# EAGLE design main_board (EAGLE 9.4.2)
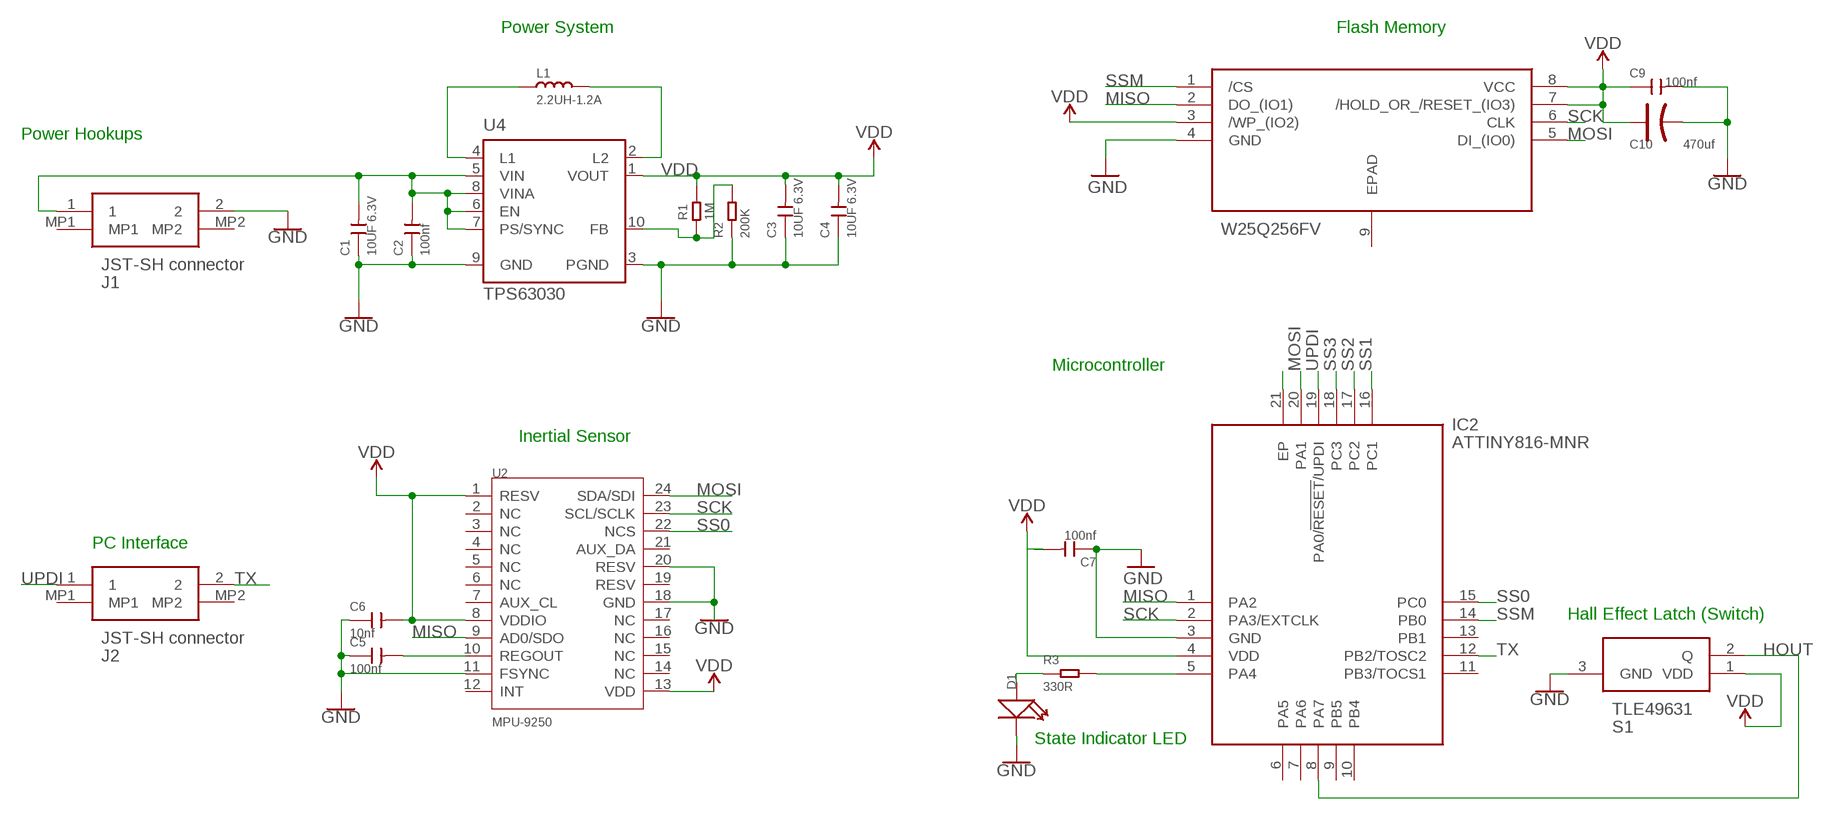
[diagram p0: schematic, sheet 1]

## Parts
C1  10UF 6.3V  CERAMIC-10UF-6.3V-20%-X5R(0603)  [C0603]
C2  100nf  CERAMIC-100NF-50V-10%-X7R(0603)  [C0603]
C3  10UF 6.3V  CERAMIC-10UF-6.3V-20%-X5R(0603)  [C0603]
C4  10UF 6.3V  CERAMIC-10UF-6.3V-20%-X5R(0603)  [C0603]
C5  100nf  CERAMIC-100NF-25V-10%-X7R(0402)  [C0402]
C6  10nf  CERAMIC-10NF-50V-10%-X7R(0402)  [C0402]
C7  100nf  CERAMIC-100NF-50V-10%-X7R(0603)  [C0603]
C9  100nf  CERAMIC-100NF-50V-10%-X7R(0603)  [C0603]
C10  470uf  TANTALUM-SMD-470UF-6.3V(AVX-D)  [AVX-D]
D1  YELLOW-0603  SMD-LED-CLEAR-YELLOW(0603)  [LED-0603]
IC1  W25Q256FV  W25Q256FVEIQ  [SON127P800X600X80-9N]
IC2  ATTINY816-MNR  [QFN40P300X300X90-21N]
J1  JST-SH connector  BM02B-SRSS-TB(LF)(SN)  [BM02BSRSSTBLFSN]
J2  JST-SH connector  BM02B-SRSS-TB(LF)(SN)  [BM02BSRSSTBLFSN]
L1  2.2UH-1.2A  SMD-INDUCTOR-2.2UH-20%-1.2A(0805)  [L0805]
R1  1M  SMD-RES-1M-5%-1/16W(0402)  [R0402]
R2  200K  SMD-RES-200K-5%-1/10W(0603)  [R0603]
R3  330R  SMD-RES-330R-1%-1/16W(0402)  [R0402]
S1  TLE49631  TLE49631MXTSA1  [SOT95P240X110-3N]
U2  MPU-9250  MOTION/POSITION-MPU-9250(QFN24G)  [QFN24G-0.4-3X3MM]
U4  TPS63030  TPS63030DSKR  [DRC-S-PVSON-N10]

## Nets
GND: C1.1 C2.1 C3.1 C4.1 C5.1 C6.1 C7.1 C9.2 C10.- D1.- IC1.4(GND) IC2.3(GND) J1.2 R2.1 S1.3(GND) U2.11(FSYNC) U2.18(GND) U2.20(RESV) U4.3(PGND) U4.9(GND)
HOUT: IC2.8(PA7) S1.2(Q)
MISO: IC1.2(DO_(IO1)) IC2.1(PA2) U2.9(AD0/SDO)
MOSI: IC1.5(DI_(IO0)) IC2.20(PA1) U2.24(SDA/SDI)
N$1: D1.+ R3.1
N$2: L1.1 U4.4(L1)
N$3: L1.2 U4.2(L2)
N$4: R1.1 R2.2 U4.10(FB)
N$5: IC2.21(EP)
N$6: C1.2 C2.2 J1.1 U4.5(VIN) U4.6(EN) U4.7(PS/SYNC) U4.8(VINA)
N$7: IC2.5(PA4) R3.2
N$10: C5.2 U2.10(REGOUT)
SCK: IC1.6(CLK) IC2.2(PA3/EXTCLK) U2.23(SCL/SCLK)
SS0: IC2.15(PC0) U2.22(NCS)
SS1: IC2.16(PC1)
SS2: IC2.17(PC2)
SS3: IC2.18(PC3)
SSM: IC1.1(/CS) IC2.14(PB0)
TX: IC2.12(PB2/TOSC2) J2.2
UPDI: IC2.19(PA0/!RESET!/UPDI) J2.1
VDD: C3.2 C4.2 C6.2 C7.2 C9.1 C10.+ IC1.3(/WP_(IO2)) IC1.7(/HOLD_OR_/RESET_(IO3)) IC1.8(VCC) IC2.4(VDD) R1.2 S1.1(VDD) U2.1(RESV) U2.8(VDDIO) U2.13(VDD) U4.1(VOUT)
Unconnected: IC1.9(EPAD) IC2.6(PA5) IC2.7(PA6) IC2.9(PB5) IC2.10(PB4) IC2.11(PB3/TOCS1) IC2.13(PB1) J1.MP1 J1.MP2 J2.MP1 J2.MP2 U2.2(NC) U2.3(NC) U2.4(NC) U2.5(NC) U2.6(NC) U2.7(AUX_CL) U2.12(INT) U2.14(NC) U2.15(NC) U2.16(NC) U2.17(NC) U2.19(RESV) U2.21(AUX_DA)

## Notes on the sheet
- Power System | Flash Memory
- Power Hookups
- Microcontroller
- Inertial Sensor
- PC Interface
- Hall Effect Latch (Switch)
- State Indicator LED

## Library data of the parts
C1 C3 C4 = OPL_Capacitor:CERAMIC-10UF-6.3V-20%-X5R(0603): 302010286; MPN: CC0603MRX5R5BB106
C2 C7 C9 = OPL_Capacitor:CERAMIC-100NF-50V-10%-X7R(0603): 302010138; MPN: CC0603KRX7R9BB104
C5 = OPL_Capacitor:CERAMIC-100NF-25V-10%-X7R(0402): 302010024; MPN: CC0402KRX7R8BB104
C6 = OPL_Capacitor:CERAMIC-10NF-50V-10%-X7R(0402): 302010006; MPN: CC0402KRX7R9BB103
C10 = OPL_Capacitor:TANTALUM-SMD-470UF-6.3V(AVX-D): 302020027; MPN: TAJD477*006#NJ
D1 = OPL_Optoelectronics:SMD-LED-CLEAR-YELLOW(0603): 304090044; MPN: 19-217-Y5C-AM1N1VY-3T
IC1 = W25Q256FVEIQ:W25Q256FVEIQ: 3V 256M-BIT SERIAL FLASH MEMORY WITH DUAL/QUAD SPI & QPI Source: Datasheet <https://www.winbond.com/resource-files/w25q256fv revi 02262016 kms.pdf>; DESCRIPTION: 3V 256M-BIT SERIAL FLASH MEMORY WITH DUAL/QUAD SPI & QPI; HEIGHT: 0.8mm; MANUFACTURER_NAME: Winbond; MANUFACTURER_PART_NUMBER: W25Q256FVEIQ
IC2 = ATTINY816-MNR:ATTINY816-MNR: 8-bit Microcontrollers - MCU AVR 8-bit Microcontroller Source: Datasheet <https://componentsearchengine.com/Datasheets/1/ATTINY816-MNR.pdf>; DESCRIPTION: 8-bit Microcontrollers - MCU AVR 8-bit Microcontroller; HEIGHT: 0.9mm; MANUFACTURER_NAME: Microchip; MANUFACTURER_PART_NUMBER: ATTINY816-MNR; MOUSER_PART_NUMBER: 579-ATTINY816-MNR; MOUSER_PRICE-STOCK: https://www.mouser.com/Search/Refine.aspx?Keyword=579-ATTINY816-MNR
J1 J2 = BM02B-SRSS-TB(LF)(SN):BM02B-SRSS-TB(LF)(SN): Wire To Board / Wire To Wire Connector SMD,P=1mm RoHS Source: Datasheet <http://www.jst-mfg.com/product/pdf/eng/eSR.pdf>; DESCRIPTION: Wire To Board / Wire To Wire Connector SMD,P=1mm RoHS; HEIGHT: 4.25mm; MANUFACTURER_NAME: JST Sales America; MANUFACTURER_PART_NUMBER: BM02B-SRSS-TB(LF)(SN)
L1 = OPL_Inductor:SMD-INDUCTOR-2.2UH-20%-1.2A(0805): 303010086; MPN: LQM2MPN2R2MG0
R1 = OPL_Resistor:SMD-RES-1M-5%-1/16W(0402): 301010009; MPN: RC0402JR-071ML
R2 = OPL_Resistor:SMD-RES-200K-5%-1/10W(0603): 301010212; MPN: RC0603JR-07200KL
R3 = OPL_Resistor:SMD-RES-330R-1%-1/16W(0402): 301011998; MPN: RC0402FR-07330RL
S1 = TLE49631MXTSA1:TLE49631MXTSA1: INFINEON - TLE49631MXTSA1 - Hall Effect Switch, High Precision, Latching, 0.002 T, -0.002 T, 3 V, 5.5 V, SOT-23 Source: Datasheet <https://ew.componentsearchengine.com/Datasheets/2/TLE49631MXTSA1.pdf>; DESCRIPTION: INFINEON - TLE49631MXTSA1 - Hall Effect Switch, High Precision, Latching, 0.002 T, -0.002 T, 3 V, 5.5 V, SOT-23; HEIGHT: 1.1mm; MANUFACTURER_NAME: Infineon; MANUFACTURER_PART_NUMBER: TLE49631MXTSA1
U2 = OPL_Sensor-Transducer:MOTION/POSITION-MPU-9250(QFN24G): 314990005
U4 = Seeed_extras:TPS63030DSKR: Buck-Boost Switching Regulator IC Positive Adjustable 1.2V 1 Output 900mA (Switch) 10-WFDFN Exposed

## Board
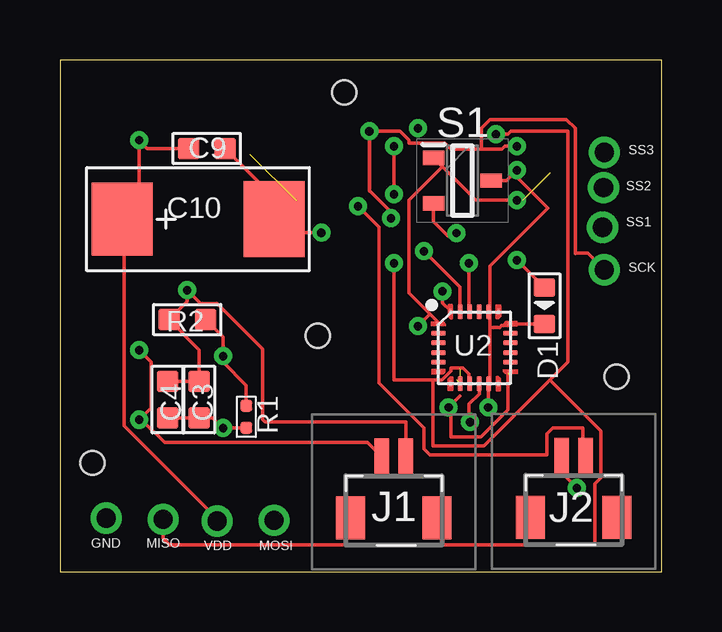
[diagram p1: board, top side]
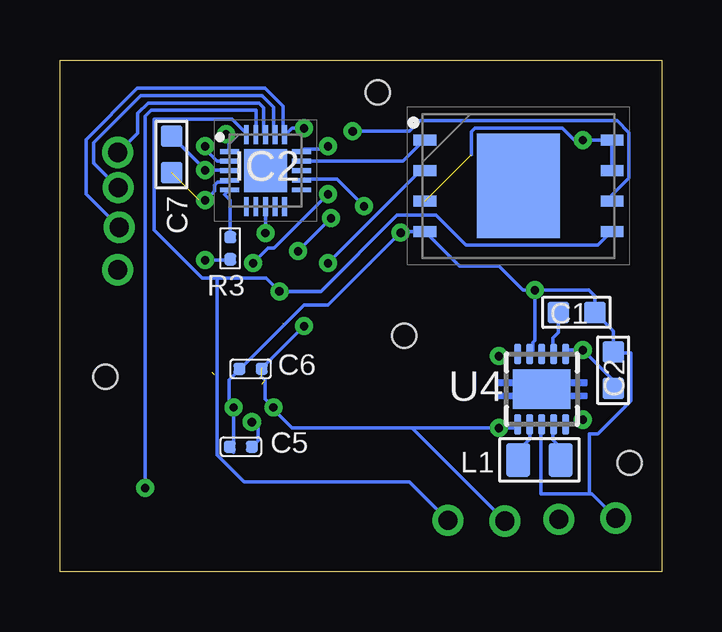
[diagram p2: board, bottom side, seen from below]

Size 25.1 x 21.35 mm. Coordinates in mm from the lower left corner, seen from the top.
Outline: 0,0 25.1,0 25.1,21.35 0,21.35 0,0
Copper layers (1*16): Top 0.035mm / dielectric 1.5mm / Bottom 0.035mm
Design rules "default *": minimum track width 6mil, minimum drill 0.3mm, track to track 6mil, track to pad 6mil, pad to pad 6mil, via to via 6mil, smd to smd 6mil, copper to edge 40mil, drill to drill 6mil, minimum pad ring 10mil, minimum via ring 8mil, stop-mask expansion 4mil, vias tented up to drill 0mil, thermal gap 10mil
Holes 1 mm at 1.35,4.55 11.85,20 23.2,8.15 10.75,9.85

### Footprints (pad centres in the part's own frame; a part is rotated, then mirrored left to right if it is on the bottom)
C0603 = smd 0.889 x 0.889: 1 0,0.762; 2 0,-0.762
C0402 = smd 0.5 x 0.5: 1 0,0.463; 2 0,-0.463
AVX-D = smd 2.54 x 3.048: + -3.175,0 | smd 2.54 x 3.175: - 3.175,0
LED-0603 = smd 0.762 x 0.889: + -0.762,0; - 0.762,0
SON127P800X600X80-9N = smd 0.95 x 0.45: 1 -3.9,1.905; 2 -3.9,0.635; 3 -3.9,-0.635; 4 -3.9,-1.905; 5 3.9,-1.905; 6 3.9,-0.635; 7 3.9,0.635; 8 3.9,1.905 | smd 3.45 x 4.35: 9 0,0
QFN40P300X300X90-21N = smd 0.8 x 0.2: 1 -1.5,0.8; 2 -1.5,0.4; 3 -1.5,0; 4 -1.5,-0.4; 5 -1.5,-0.8; 11 1.5,-0.8; 12 1.5,-0.4; 13 1.5,0; 14 1.5,0.4; 15 1.5,0.8 | smd 0.2 x 0.8: 6 -0.8,-1.5; 7 -0.4,-1.5; 8 0,-1.5; 9 0.4,-1.5; 10 0.8,-1.5; 16 0.8,1.5; 17 0.4,1.5; 18 0,1.5; 19 -0.4,1.5; 20 -0.8,1.5 | smd 1.8 x 1.8: 21 0,0
BM02BSRSSTBLFSN = smd 0.6 x 1.55: 1 -0.5,1.837; 2 0.5,1.837 | smd 1.2 x 1.8: MP1 -1.8,-0.688; MP2 1.8,-0.688
L0805 = smd 1.016 x 1.397: 1 -0.889,0; 2 0.889,0
R0402 = smd 0.5 x 0.5: 1 0,0.463; 2 0,-0.463
R0603 = smd 0.889 x 0.889: 1 0,0.762; 2 0,-0.762
SOT95P240X110-3N = smd 0.9 x 0.6: 1 -1.2,0.95; 2 -1.2,-0.95; 3 1.2,0
QFN24G-0.4-3X3MM = smd 0.2 x 0.15: 1 -1.5,1; 6 -1.5,-1; 13 1.5,-1; 18 1.5,1 | smd 0.6 x 0.2: 2 -1.5,0.6; 3 -1.5,0.2; 4 -1.5,-0.2; 5 -1.5,-0.6; 14 1.5,-0.6; 15 1.5,-0.2; 16 1.5,0.2; 17 1.5,0.6 | smd 0.15 x 0.2: 7 -1,-1.5; 12 1,-1.5; 19 1,1.5; 24 -1,1.5 | smd 0.2 x 0.6: 8 -0.6,-1.5; 9 -0.2,-1.5; 10 0.2,-1.5; 11 0.6,-1.5; 20 0.6,1.5; 21 0.2,1.5; 22 -0.2,1.5; 23 -0.6,1.5
DRC-S-PVSON-N10 = smd 0.28 x 0.85: 1 -1,-1.475; 2 -0.5,-1.475; 3 0,-1.475; 4 0.5,-1.475; 5 1,-1.475; 6 1,1.475; 7 0.5,1.475; 8 0,1.475; 9 -0.5,1.475; 10 -1,1.475 | smd 2.4 x 1.65: TH 0,0

### Placement (x,y rotation side)
C1  3.56,10.82 270 bottom
C2  2.03,8.41 0 bottom
C3  5.81,7.19 0 top
C4  4.48,7.19 0 top
C5  17.56,5.22 90 bottom
C6  17.15,8.47 90 bottom
C7  20.45,17.41 0 bottom
C9  6.12,17.66 90 top
C10  5.76,14.71 0 top
D1  20.2,11.1 270 top
IC1  5.98,16.1 0 bottom
IC2  16.53,16.73 0 bottom
J1  13.92,2.95 0 top
J2  21.42,2.97 0 top
L1  5.11,4.67 180 bottom
R1  7.77,6.47 0 top
R2  5.31,10.52 90 top
R3  18,13.5 180 bottom
S1  16.78,16.32 0 top
U2  17.28,9.35 0 top
U4  5.01,7.62 0 bottom

### Tracks (layer width: path | path; a pad name or v marks a point on that pad's centre or on a via)
GND  (via drill 0.35, 0.8 pad 1.3)
  Top 0.152: v17.86,6.86 17.86,7.83 U2.11 17.93,7.88 17.93,10.2 | S1.3 18.62,16.32 v19.05,16.75 19.05,16.47 20.35,15.17 17.93,12.75 17.93,10.88 U2.20 17.93,10.75 17.93,10.2 | C4.1 C3.1 5.81,9.26 R2.1 5.3,11.27 v5.3,11.75 5.86,11.19 6.55,11.19 8.45,9.29 8.45,6.35 8.55,6.25 14.42,6.25 J1.2 | v10.9,14.15 9.49,14.15 C10.- 8.94,15.61 C9.2 | 17.93,10.2 18.34,10.2 18.41,10.28 18.71,10.28 U2.18 20.19,10.35 D1.-
  Bottom 0.152: C5.1 17.86,5 v17.86,6.86 18.05,7.05 18.05,8 17.61,8.44 C6.1 17.55,8.5 14.93,11.12 13.93,11.12 v10.9,14.15 10.9,14.2 IC1.4 8.44,12.75 6.8,12.75 5.8,11.75 v5.3,11.75 | IC2.3 18.05,16.75 v19.05,16.75 19.05,16.77 C7.1 | v5.3,11.75 5.3,9.65 5.38,9.57 5.38,9.23 U4.9 | v5.3,11.75 3.05,11.75 2.8,11.5 C1.1 2.03,10.05 C2.1 1.93,9.12 1.3,9.12 1.3,7.12 2.67,5.75 3.02,5.75 3.02,3.25 | 3.02,3.25 2.92,3.25 v1.93,2.25 | 3.02,3.25 5.05,3.25 5.05,6.12 U4.3
HOUT  (via drill 0.35)
  Top 0.152: v16.53,14.13 16.3,14.13 16.18,14.02 15.58,14.62 S1.2
  Bottom 0.152: v16.53,14.13 IC2.8
MISO  (via drill 0.35, 0.8 pad 1.3)
  Top 0.152: 15.55,8 13.93,8 v13.93,12.88 | 15.55,8 15.93,8 16.3,8.38 16.3,8.5 16.8,8.5 17.05,8.25 17.05,7.88 U2.9 | v18.18,18.25 18.68,18.25 18.8,18.38 21.18,18.38 21.18,8.75 20.43,8 | 20.43,8 17.68,5.25 15.55,5.25 15.55,8 | 20.43,8 22.55,5.88 22.55,3.92 22.3,3.67 22.3,1.12 4.58,1.12 4.3,1.4 v4.3,2.2
  Bottom 0.152: v13.93,12.88 10.18,16.62 9.93,16.62 IC1.2 | v18.18,18.25 18.05,18.25 18.05,17.62 IC2.1
MOSI  (via drill 0.35, 0.8 pad 1.3)
  Top 0.152: v15.95,11.7 15.95,11.22 16.3,10.88 U2.24
  Bottom 0.152: 18.55,12.25 19.18,12.25 21.18,14.25 21.18,18.88 17.93,18.88 17.3,18.25 IC2.20 | 18.55,12.25 16.5,12.25 v15.95,11.7 14.22,11.7 11.05,14.88 9.43,14.88 8.18,13.62 2.67,13.62 2.17,14.12 IC1.5 | v8.93,2.15 10.53,3.75 17.43,3.75 18.55,4.88 18.55,12.25
N$1  (via drill 0.35)
  Top 0.152: D1.+ 19.06,13 v19.05,13
  Bottom 0.152: v19.05,13 18.04,13 R3.1
N$2
  Bottom 0.152: L1.1 4.22,5.17 4.55,5.5 4.55,6.11 U4.4
N$3
  Bottom 0.152: L1.2 6,5.05 5.51,5.54 U4.2
N$4  (via drill 0.35)
  Top 0.152: R1.1 7.77,7.78 6.8,8.75 v6.8,9 6.8,9.79 R2.2
  Bottom 0.152: U4.10 6.71,9.1 v6.8,9
N$6  (via drill 0.35)
  Top 0.152: v3.3,9.25 3.8,8.75 3.8,6.85 v3.3,6.35 3.41,6.35 4.37,5.39 12.81,5.39 J1.1
  Bottom 0.152: U4.8 4.55,9.1 | 4.55,9.1 U4.7 U4.6 3.85,9.25 v3.3,9.25 2.03,7.98 C2.2 | U4.5 3.65,6.14 3.45,6.35 v3.3,6.35 | C1.2 4.32,9.98 4.55,9.75 4.55,9.1
N$7
  Bottom 0.152: IC2.5 18.23,15.73 18,15.5 R3.2
N$10  (via drill 0.35)
  Top 0.152: U2.10 17.48,7.43 17.05,7 17.05,6.3 v17.1,6.25
  Bottom 0.152: v17.1,6.25 16.99,6.25 16.85,6.17 16.85,5.47 C5.2
SCK  (via drill 0.35, 0.8 pad 1.3)
  Top 0.152: v15.18,13.38 16.68,11.88 16.68,10.88 U2.23 | v13.8,14.75 13.8,15 12.93,15.88 12.9,15.88 v12.9,18.38 14.18,18.38 14.55,18 14.55,17.88 16.05,17.88 16.3,17.62 17.5,17.62 | v19.05,17.75 18.55,17.75 18.43,17.62 17.5,17.62 | 21.48,13.27 21.48,13.3 | 21.48,13.3 21.48,18.5 21.12,18.86 17.92,18.86 17.57,18.5 17.57,17.69 17.5,17.62 | 21.48,13.3 22,13.3 v22.7,12.6
  Bottom 0.152: v13.8,14.75 v15.18,13.38 | v19.05,17.75 19.05,17.62 18.55,17.12 18.05,17.12 IC2.2 | v12.9,18.38 10.53,18.38 10.1,18.81 1.86,18.81 1.38,18.32 1.38,16.41 2.08,15.71 IC1.6
SS0  (via drill 0.35)
  Top 0.152: v17.05,12.88 17.05,10.88 U2.22 | v13.93,17.75 v13.93,15.75
  Bottom 0.152: v17.05,12.88 16.43,13.5 16.18,13.5 v13.93,15.75 | v13.93,17.75 14.05,17.62 14.93,17.62 IC2.15
SS1  (via drill 0.35, 0.8 pad 1.3)
  Bottom 0.152: v14.93,18.5 15.43,18.5 15.68,18.25 IC2.16 15.8,18.3 15.8,19.42 16.55,20.16 21.87,20.16 24,18.03 24,15.76 v22.63,14.37
SS2  (via drill 0.8 pad 1.3)
  Bottom 0.152: v22.67,16.02 23.7,17.05 23.7,17.91 21.75,19.86 16.67,19.86 16.2,19.39 16.2,18.3 IC2.17
SS3  (via drill 0.8 pad 1.3)
  Bottom 0.152: IC2.18 16.6,18.3 16.6,19.36 16.8,19.55 21.43,19.55 21.86,19.13 21.86,18.3 22.65,17.5 v22.7,17.5
SSM
  Bottom 0.152: IC2.14 14.93,17.12 10.8,17.12 9.93,18 IC1.1
TX  (via drill 0.35)
  Top 0.152: v12.43,15.25 13.3,14.38 13.3,7.88 15.18,6 15.18,5.12 15.43,4.88 20.3,4.88 20.3,5.75 20.55,6 21.8,6 21.8,4.9 J2.2
  Bottom 0.152: v12.43,15.25 13.55,16.38 14.93,16.38 IC2.12
UPDI  (via drill 0.35)
  Top 0.152: v21.55,3.5 20.93,4.12 20.93,4.78 J2.1
  Bottom 0.152: v21.55,3.5 21.55,19 21.3,19.25 16.93,19.25 16.93,18.25 IC2.19
VDD  (via drill 0.35, 0.8 pad 1.3)  (7 unrouted)
  Top 0.152: 16.68,7.34 v16.2,6.86 16.3,6.75 16.3,5.62 17.55,5.62 18.68,6.75 18.68,8.24 | S1.1 15.95,16.9 | 15.95,16.9 17.35,15.5 v19.05,15.5 | R1.2 v6.8,6 6.37,6.43 C3.2 C4.2 | C9.1 3.65,17.66 v3.3,18 3.3,15.43 C10.+ 2.67,14.62 2.67,6.1 6.55,2.23 v6.55,2.12 | 15.43,10.75 14.55,11.62 14.55,15.5 15.95,16.9 | 15.43,10.75 15.8,10.38 | v14.93,10.25 15.43,10.75
  Bottom 0.152: 16.69,8.14 16.55,8 16.55,7.21 v16.2,6.86 16.18,6.75 15.43,6 10.43,6 | IC2.4 18.1,16.26 18.52,16.26 18.66,16.12 18.66,15.89 v19.05,15.5 19.3,15.5 | U4.1 6.16,6 v6.8,6 10.43,6 | IC1.7 IC1.8 v3.3,18 3.66,18 4.16,18.5 7.8,18.5 7.93,18.37 7.93,17.41 | 16.68,8.5 v14.93,10.25 | v6.55,2.12 10.43,6

### Text on the board
tNames: SS3 | SS2 | SS1 | SCK | GND | MISO | VDD | MOSI